# EAGLE schematic mainboard (EAGLE 9.1.3)

## Sheet 1 of 5: Avionics
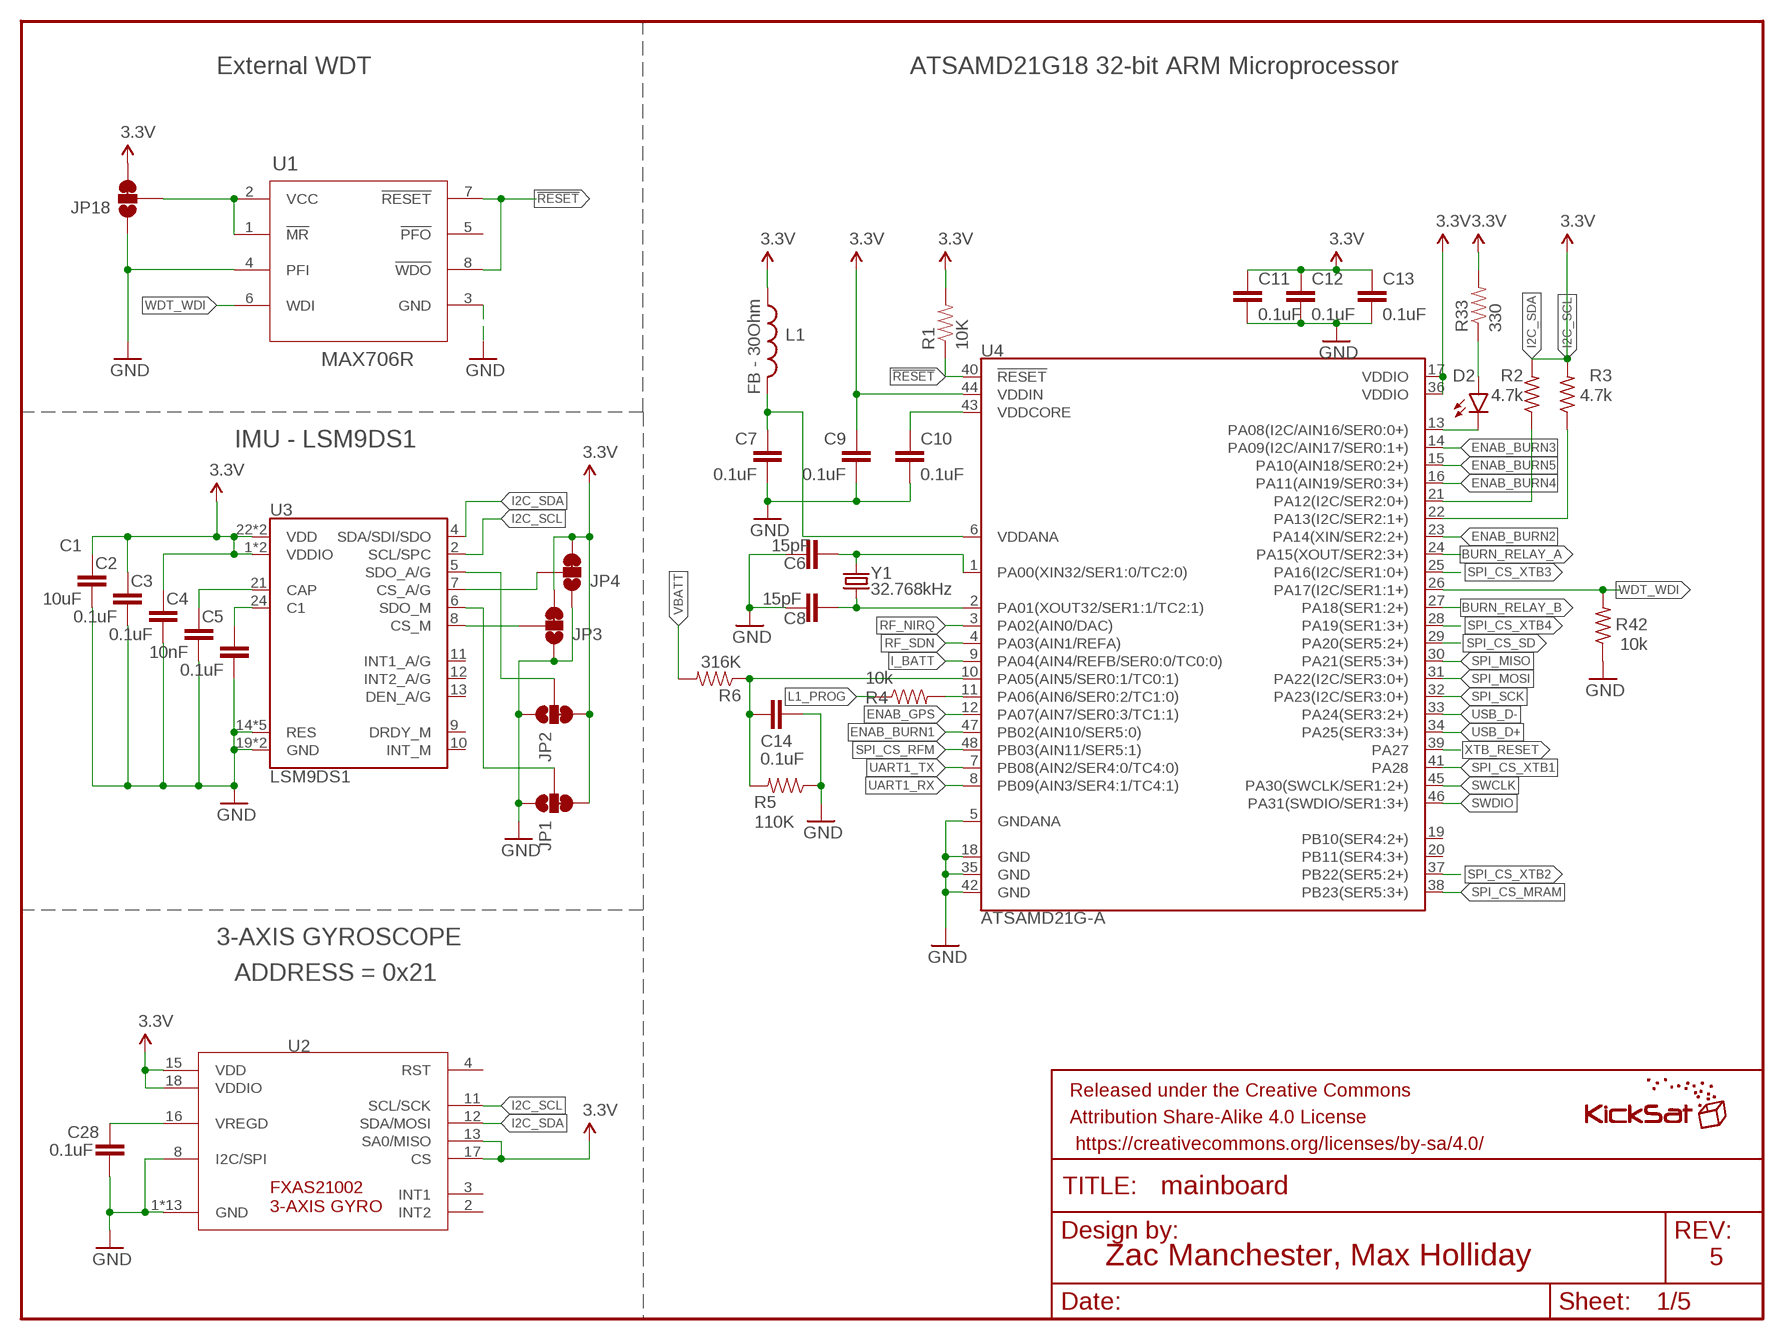
[diagram p0: schematic, sheet 1]

### Parts
C1  10uF  10UF-6.3V-20%(0603)  [0603-CAP]
C2  0.1uF  0.1UF-25V(+80/-20%)(0603)  [0603-CAP]
C3  0.1uF  0.1UF-25V(+80/-20%)(0603)  [0603-CAP]
C4  10nF  10NF/10000PF-50V-10%(0603)  [0603-CAP]
C5  0.1uF  0.1UF-25V(+80/-20%)(0603)  [0603-CAP]
C6  15pF  15PF-50V-5%(0603)  [0603-CAP@1]
C7  0.1uF  0.1UF-25V(+80/-20%)(0603)  [0603-CAP]
C8  15pF  15PF-50V-5%(0603)  [0603-CAP@1]
C9  0.1uF  0.1UF-25V(+80/-20%)(0603)  [0603-CAP]
C10  0.1uF  0.1UF-25V(+80/-20%)(0603)  [0603-CAP]
C11  0.1uF  0.1UF-25V(+80/-20%)(0603)  [0603-CAP]
C12  0.1uF  0.1UF-25V(+80/-20%)(0603)  [0603-CAP]
C13  0.1uF  0.1UF-25V(+80/-20%)(0603)  [0603-CAP]
C14  0.1uF  0.1UF-25V(+80/-20%)(0603)  [0603-CAP]
C28  0.1uF  0.1UF-25V(+80/-20%)(0603)  [0603-CAP]
D2  GREEN  LED-GREEN0603  [LED-0603]
FRAME1  FRAME-LETTER  [CREATIVE_COMMONS]
JP1  JUMPER-PAD-3-2OF3_NC_BY_TRACE_SMALL  [PAD-JUMPER-3-2OF3_NC_BY_TRACE_YES_SILK_FULL_BOX]
JP2  JUMPER-PAD-3-2OF3_NC_BY_TRACE_SMALL  [PAD-JUMPER-3-2OF3_NC_BY_TRACE_YES_SILK_FULL_BOX]
JP3  JUMPER-PAD-3-2OF3_NC_BY_TRACE_SMALL  [PAD-JUMPER-3-2OF3_NC_BY_TRACE_YES_SILK_FULL_BOX]
JP4  JUMPER-PAD-3-2OF3_NC_BY_TRACE_SMALL  [PAD-JUMPER-3-2OF3_NC_BY_TRACE_YES_SILK_FULL_BOX]
JP18  JUMPER-PAD-3-2OF3_NC_BY_TRACE_SMALL  [PAD-JUMPER-3-2OF3_NC_BY_TRACE_YES_SILK_FULL_BOX]
L1  FB - 30Ohm  INDUCTOR0603  [0603]
L2  KICKSAT_LOGO  [KICKSAT_LOGO]
R1  10K  10KOHM-1/10W-1%(0603)0603  [0603-RES]
R2  4.7k  R-US_R0603  [R0603]
R3  4.7k  R-US_R0603  [R0603]
R4  10k  10KOHM-1/10W-1%(0603)0603  [0603-RES]
R5  110K  10KOHM-1/10W-1%(0603)0603  [0603-RES]
R6  316K  10KOHM-1/10W-1%(0603)0603  [0603-RES]
R33  330  330OHM1/10W1%(0603)  [0603-RES]
R42  10k  R-US_R0603  [R0603]
U1  MAX706R  MAX708RESA-T  [SO8]
U2  FXAS21002FXAS21002  [QFN50P456X400X100-24]
U3  LSM9DS1  [LGA24-8X4]
U4  ATSAMD21G-A  [TQFP-48]
Y1  32.768kHz  CRYSTAL3.2X1.5MM  [CRYSTAL-SMD-3.2X1.5MM]

### Nets
3.3V: C1.1 C2.1 C3.1 C9.1 C11.1 C12.1 C13.1 JP1.3 JP2.3 JP3.3 JP4.3 JP18.3 L1.1 R1.2 R2.2 R3.2 R33.2 U2.13(SA0/MISO) U2.15(VDD) U2.17(CS) U2.18(VDDIO) U3.1(VDDIO) U3.3(VDDIO) U3.22(VDD) U3.23(VDD) U4.17(VDDIO) U4.36(VDDIO) U4.44(VDDIN) ; also sheet 2,3,4
!RESET: R1.1 U1.7(!RESET) U1.8(!WDO) U4.40(!RESET!) ; also sheet 3
BURN_RELAY_A: U4.24(PA15(XOUT/SER2:3+)) ; also sheet 5
BURN_RELAY_B: U4.27(PA18(SER1:2+)) ; also sheet 5
ENAB_BURN1: U4.47(PB02(AIN10/SER5:0)) ; also sheet 5
ENAB_BURN2: U4.23(PA14(XIN/SER2:2+)) ; also sheet 5
ENAB_BURN3: U4.14(PA09(I2C/AIN17/SER0:1+)) ; also sheet 5
ENAB_BURN4: U4.16(PA11(AIN19/SER0:3+)) ; also sheet 5
ENAB_BURN5: U4.15(PA10(AIN18/SER0:2+)) ; also sheet 5
ENAB_GPS: U4.12(PA07(AIN7/SER0:3/TC1:1)) ; also sheet 2
GND: C1.2 C2.2 C3.2 C4.2 C5.2 C6.1 C7.2 C8.2 C9.2 C10.2 C11.2 C12.2 C13.2 C14.2 C28.1 JP1.1 JP2.1 JP3.1 JP4.1 JP18.1 R5.1 R42.1 U1.3(GND) U1.4(PFI) U2.1(GND) U2.5(GND) U2.6(GND) U2.7(GND) U2.8(I2C/SPI) U2.9(GND) U2.10(GND) U2.14(GND) U2.19(GND) U2.20(GND) U2.21(GND) U2.22(GND) U2.23(GND) U2.24(GND) U3.14(RES) U3.15(RES) U3.16(RES) U3.17(RES) U3.18(RES) U3.19(GND) U3.20(GND) U4.5(GNDANA) U4.18(GND) U4.35(GND) U4.42(GND) ; also sheet 2,3,4,5
I2C_SCL: R3.1 U2.11(SCL/SCK) U3.2(SCL/SPC) U4.22(PA13(I2C/SER2:1+))
I2C_SDA: R2.1 U2.12(SDA/MOSI) U3.4(SDA/SDI/SDO) U4.21(PA12(I2C/SER2:0+))
I2C_SDOA/G: JP2.2 U3.5(SDO_A/G)
I_BATT: U4.9(PA04(AIN4/REFB/SER0:0/TC0:0)) ; also sheet 2
L1_PROG: R4.1 ; also sheet 2
N$1: D2.A R33.1
N$2: C4.1 U3.21(CAP)
N$6: C5.1 U3.24(C1)
N$8: JP18.2 U1.1(!MR) U1.2(VCC)
N$13: C14.1 R5.2 R6.1 U4.10(PA05(AIN5/SER0:1/TC0:1))
N$18: C7.1 L1.2 U4.6(VDDANA)
N$21: JP1.2 U3.6(SDO_M)
N$22: C28.2 U2.16(VREGD)
N$23: JP3.2 U3.8(CS_M)
N$26: JP4.2 U3.7(CS_A/G)
N$28: C6.2 U4.1(PA00(XIN32/SER1:0/TC2:0)) Y1.P$2
N$29: C8.1 U4.2(PA01(XOUT32/SER1:1/TC2:1)) Y1.P$1
N$39: R4.2 U4.11(PA06(AIN6/SER0:2/TC1:0))
N$53: D2.C U4.13(PA08(I2C/AIN16/SER0:0+))
RF_NIRQ: U4.3(PA02(AIN0/DAC)) ; also sheet 4
RF_SDN: U4.4(PA03(AIN1/REFA)) ; also sheet 4
SPI_CS_MRAM: U4.38(PB23(SER5:3+)) ; also sheet 3
SPI_CS_RFM: U4.48(PB03(AIN11/SER5:1)) ; also sheet 4
SPI_CS_SD: U4.29(PA20(SER5:2+)) ; also sheet 3
SPI_CS_XTB1: U4.41(PA28) ; also sheet 4
SPI_CS_XTB2: U4.37(PB22(SER5:2+)) ; also sheet 4
SPI_CS_XTB3: U4.25(PA16(I2C/SER1:0+)) ; also sheet 4
SPI_CS_XTB4: U4.28(PA19(SER1:3+)) ; also sheet 4
SPI_MISO: U4.30(PA21(SER5:3+)) ; also sheet 3,4
SPI_MOSI: U4.31(PA22(I2C/SER3:0+)) ; also sheet 3,4
SPI_SCK: U4.32(PA23(I2C/SER3:0+)) ; also sheet 3,4
SWCLK: U4.45(PA30(SWCLK/SER1:2+)) ; also sheet 3
SWDIO: U4.46(PA31(SWDIO/SER1:3+)) ; also sheet 3
UART1_RX: U4.8(PB09(AIN3/SER4:1/TC4:1)) ; also sheet 4
UART1_TX: U4.7(PB08(AIN2/SER4:0/TC4:0)) ; also sheet 4
USB_D+: U4.34(PA25(SER3:3+)) ; also sheet 3
USB_D-: U4.33(PA24(SER3:2+)) ; also sheet 3
VBATT: R6.2 ; also sheet 2,3,5
VDDCORE3: C10.1 U4.43(VDDCORE)
WDT_WDI: R42.2 U1.6(WDI) U4.26(PA17(I2C/SER1:1+))
XTB_RESET: U4.39(PA27) ; also sheet 4
Unconnected: U1.5(!PFO) U2.2(INT2) U2.3(INT1) U2.4(RST) U3.9(DRDY_M) U3.10(INT_M) U3.11(INT1_A/G) U3.12(INT2_A/G) U3.13(DEN_A/G) U4.19(PB10(SER4:2+)) U4.20(PB11(SER4:3+))

### Notes on the sheet
- ATSAMD21G18 32-bit ARM Microprocessor
- External WDT
- Decide on HOLD and !WP
- IMU - LSM9DS1
- 3-AXIS GYROSCOPE
- To Do:
  Characterize power consumption
  Validate SPI pinout of SAMD21
- ADDRESS = 0x21
- Zac Manchester, Max Holliday | 5

## Sheet 2 of 5: Power
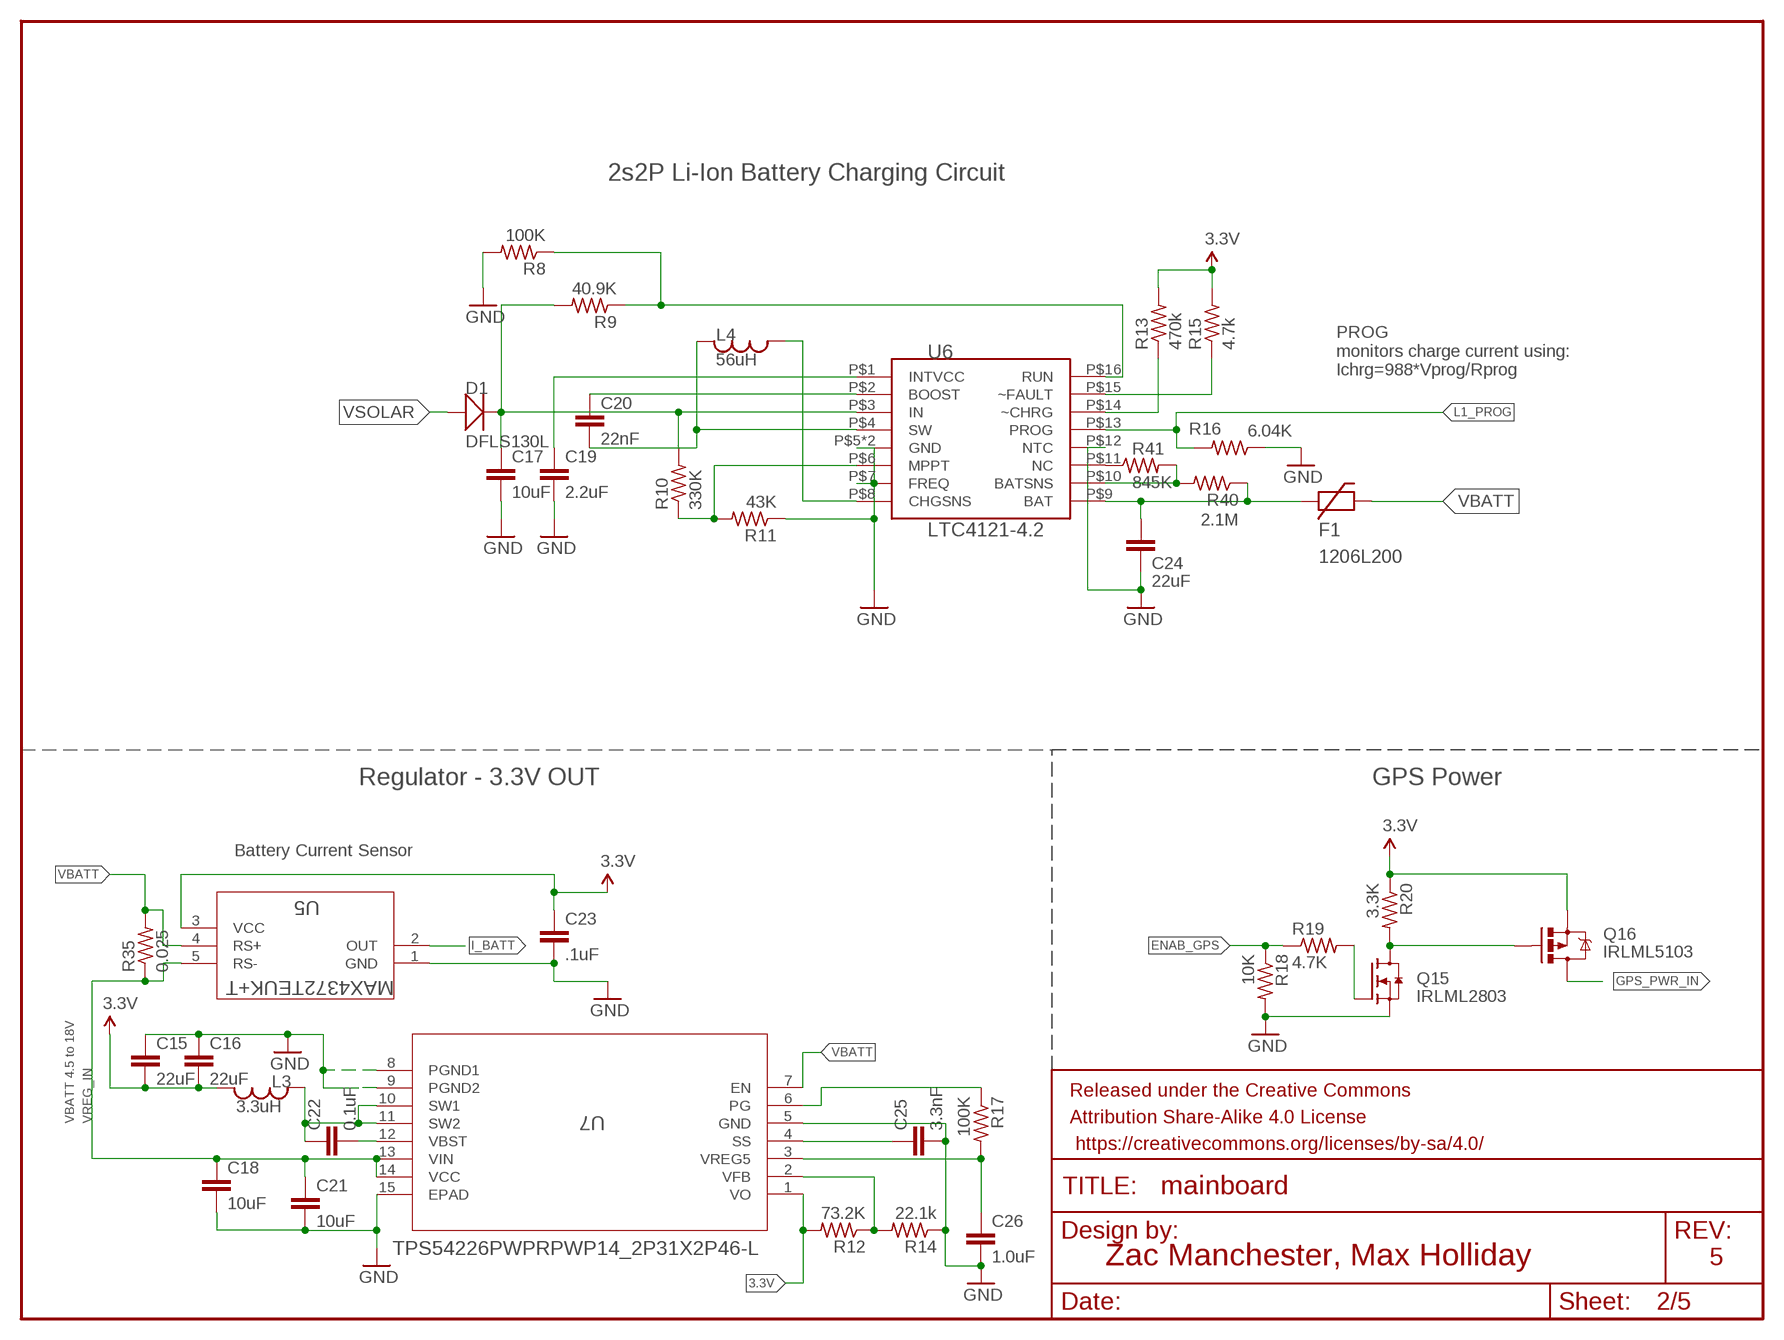
[diagram p1: schematic, sheet 2]

### Parts
C15  22uF  22UF-0805-6.3V-20%  [0805]
C16  22uF  22UF-0805-6.3V-20%  [0805]
C17  10uF  10UF-0603-6.3V-20%  [0603]
C18  10uF  10UF-0603-6.3V-20%  [0603]
C19  2.2uF  2.2UF-0603-10V-20%  [0603]
C20  22nF  2.2NF/2200PF-0603-50V-10%  [0603]
C21  10uF  10UF-0603-6.3V-20%  [0603]
C22  0.1uF  1.0UF-0603-16V-10%  [0603]
C23  .1uF  CAP0603-CAP  [0603-CAP@1]
C24  22uF  0.1UF-0603-25V-5%  [0603]
C25  3.3nF  3.3NF-0603-100V-10%  [0603]
C26  1.0uF  1.0UF-0603-16V-10%  [0603]
D1  DFLS130L  [PWRDI-123]
F1  1206L200  PTCFUSE1206  [1206]
FRAME2  FRAME-LETTER  [CREATIVE_COMMONS]
L3  3.3uH  IND1812  [1812]
L4  56uH  IND1812  [1812]
Q15  IRLML2803  IRLML2803TRPBF  [SOT-23]
Q16  IRLML5103  MOSFET-PCHANNEL  [SOT23-3]
R8  100K  R-US_R0603  [R0603]
R9  40.9K  R-US_R0603  [R0603]
R10  330K  R-US_R0603  [R0603]
R11  43K  R-US_R0603  [R0603]
R12  73.2K  R-US_R0603  [R0603]
R13  470k  R-US_R0603  [R0603]
R14  22.1k  R-US_R0603  [R0603]
R15  4.7k  R-US_R0603  [R0603]
R16  6.04K  R-US_R0603  [R0603]
R17  100K  R-US_R0603  [R0603]
R18  10K  R-US_R0603  [R0603]
R19  4.7K  R-US_R0603  [R0603]
R20  3.3K  R-US_R0603  [R0603]
R35  0.025  R-US_R2512  [R2512]
R40  2.1M  R-US_R0603  [R0603]
R41  845K  R-US_R0603  [R0603]
U5  MAX4372TEUK+T  [21-0057F]
U6  LTC4121-4.2  [QFN-16-PAD]
U7  TPS54226PWPRPWP14_2P31X2P46-L  [PWP14_2P31X2P46-L]

### Nets
3.3V: C15.2 C16.2 C23.1 L3.P$1 Q16.2(S) R12.2 R13.2 R15.2 R20.1 U5.3(VCC) U7.1(VO) ; also sheet 1,3,4
ENAB_GPS: R18.1 R19.1 ; also sheet 1
GND: C15.1 C16.1 C17.2 C18.2 C19.2 C21.2 C23.2 C24.2 C25.2 C26.2 Q15.2(S) R8.2 R11.1 R14.1 R16.1 R18.2 U5.1(GND) U6.P$5(GND) U6.P$7(FREQ) U6.P$12(NTC) U6.P$17(GND) U7.5(GND) U7.8(PGND1) U7.9(PGND2) U7.15(EPAD) ; also sheet 1,3,4,5
GPS_PWR_IN: Q16.3(D) ; also sheet 4
I_BATT: U5.2(OUT) ; also sheet 1
L1_CHG: R8.1 R9.1 U6.P$16(RUN)
L1_FAULTN: R15.1 U6.P$15(~FAULT)
L1_PROG: R16.2 U6.P$13(PROG) ; also sheet 1
LION1: C24.1 F1.1 R40.1 U6.P$9(BAT)
N$3: C22.1 L3.P$2 U7.10(SW1) U7.11(SW2)
N$10: Q15.1(G) R19.2
N$12: Q15.3(D) Q16.1(G) R20.2
N$14: C22.2 U7.12(VBST)
N$31: R40.2 R41.2 U6.P$10(BATSNS)
N$32: C20.2 L4.P$1 U6.P$4(SW)
N$33: C20.1 U6.P$2(BOOST)
N$34: C19.1 U6.P$1(INTVCC)
N$35: R10.1 R11.2 U6.P$6(MPPT)
N$36: L4.P$2 U6.P$8(CHGSNS)
N$37: R13.1 U6.P$14(~CHRG)
N$46: C26.1 R17.2 U7.3(VREG5)
N$51: C25.1 U7.4(SS)
N$52: R12.1 R14.2 U7.2(VFB)
N$54: R41.1 U6.P$11(NC)
PGOOD: R17.1 U7.6(PG)
VBATT: F1.2 R35.2 U5.4(RS+) U7.7(EN) ; also sheet 1,3,5
VREG_IN: C18.1 C21.1 R35.1 U5.5(RS-) U7.13(VIN) U7.14(VCC)
VSOLAR: D1.A ; also sheet 5
VSOLAR_IN: C17.1 D1.C R9.2 R10.2 U6.P$3(IN)

### Notes on the sheet
- 2s2P Li-Ion Battery Charging Circuit
- PROG
  monitors charge current using:
  Ichrg=988*Vprog/Rprog
- Regulator - 3.3V OUT | GPS Power
- Battery Current Sensor
- VBATT 4.5 to 18V
- Zac Manchester, Max Holliday | 5

## Sheet 3 of 5: Connectors
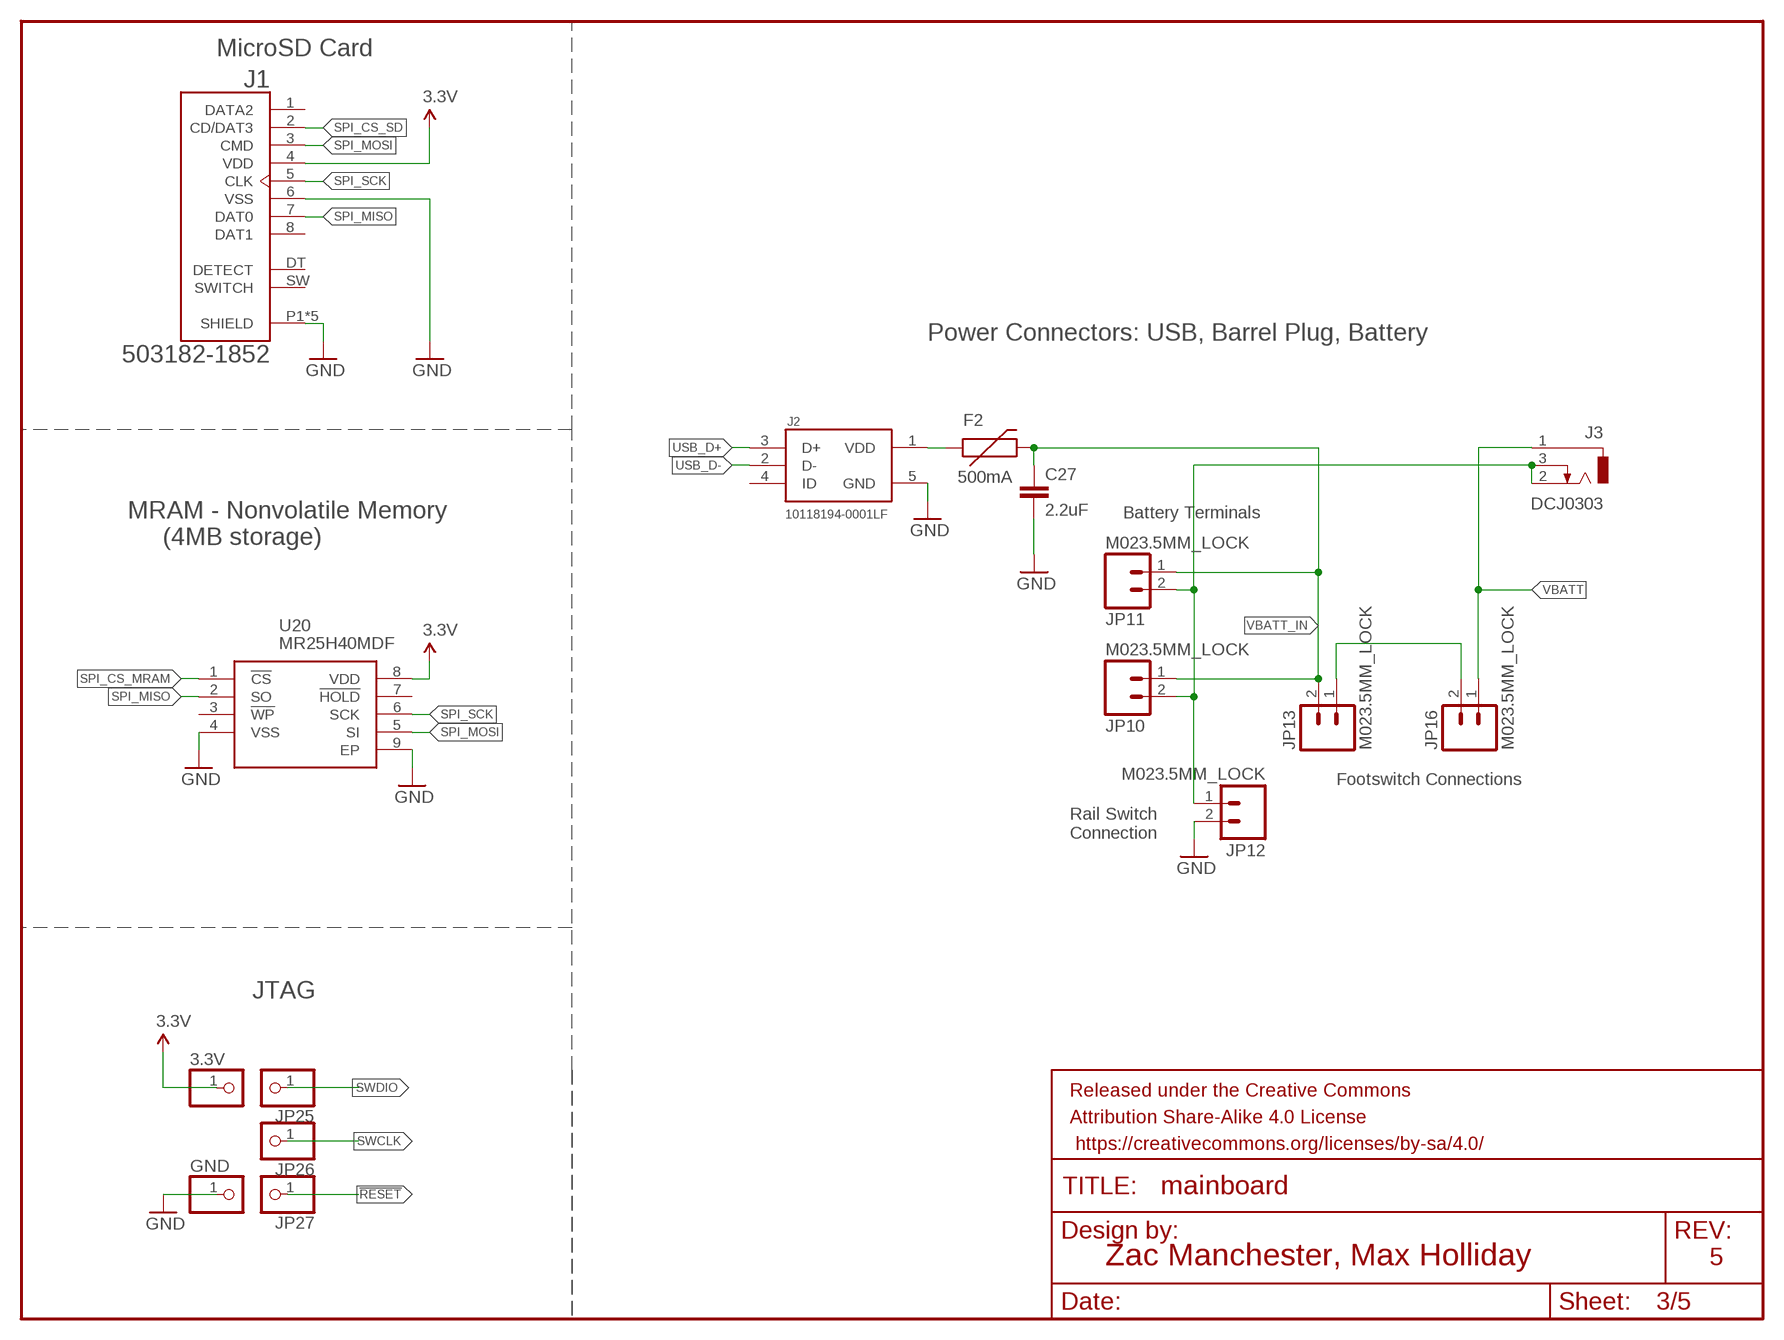
[diagram p2: schematic, sheet 3]

### Parts
3.3V  PINHD-1X1  [1X01]
C27  2.2uF  2.2UF-0603-10V-20%  [0603]
F2  500mA  PTCSMD  [PTC-1206]
FRAME3  FRAME-LETTER  [CREATIVE_COMMONS]
GND  PINHD-1X1  [1X01]
J1  503182-1852  [MOLEX_503182-1852]
J2  10118194-0001LF  [FRAMATOME_10118194-0001LF]
J3  DCJ0303  [DCJ0303]
JP10  M023.5MM_LOCK  [SCREWTERMINAL-3.5MM-2_LOCK]
JP11  M023.5MM_LOCK  [SCREWTERMINAL-3.5MM-2_LOCK]
JP12  M023.5MM_LOCK  [SCREWTERMINAL-3.5MM-2_LOCK]
JP13  M023.5MM_LOCK  [SCREWTERMINAL-3.5MM-2_LOCK]
JP16  M023.5MM_LOCK  [SCREWTERMINAL-3.5MM-2_LOCK]
JP25  PINHD-1X1  [1X01]
JP26  PINHD-1X1  [1X01]
JP27  PINHD-1X1  [1X01]
U20  MR25H40MDF  [SON127P600X500X90-9N]

### Nets
3.3V: 3.3V.1 J1.4(VDD) U20.8(VDD) ; also sheet 1,2,4
!RESET: JP27.1 ; also sheet 1
GND: C27.2 GND.1 J1.6(VSS) J1.P1(SHIELD) J1.P2(SHIELD) J1.P3(SHIELD) J1.P4(SHIELD) J1.P5(SHIELD) J2.5(GND) JP12.2 U20.4(VSS) U20.9(EP) ; also sheet 1,2,4,5
N$4: JP13.1 JP16.2
N$20: F2.1 J2.1(VDD)
N$43: J3.2 J3.3 JP10.2 JP11.2 JP12.1
SPI_CS_MRAM: U20.1(!CS) ; also sheet 1
SPI_CS_SD: J1.2(CD/DAT3) ; also sheet 1
SPI_MISO: J1.7(DAT0) U20.2(SO) ; also sheet 1,4
SPI_MOSI: J1.3(CMD) U20.5(SI) ; also sheet 1,4
SPI_SCK: J1.5(CLK) U20.6(SCK) ; also sheet 1,4
SWCLK: JP26.1 ; also sheet 1
SWDIO: JP25.1 ; also sheet 1
USB_D+: J2.3(D+) ; also sheet 1
USB_D-: J2.2(D-) ; also sheet 1
VBATT: J3.1 JP16.1 ; also sheet 1,2,5
VBATT_IN: C27.1 F2.2 JP10.1 JP11.1 JP13.2
Unconnected: J1.1(DATA2) J1.8(DAT1) J1.DT(DETECT) J1.SW(SWITCH) J2.4(ID) U20.3(!WP) U20.7(!HOLD)

### Notes on the sheet
- MicroSD Card
- Power Connectors: USB, Barrel Plug, Battery
- MRAM - Nonvolatile Memory
       (4MB storage)
- Battery Terminals
- Footswitch Connections
- Rail Switch
  Connection
- JTAG
- Zac Manchester, Max Holliday | 5

## Sheet 4 of 5: RF and GPS
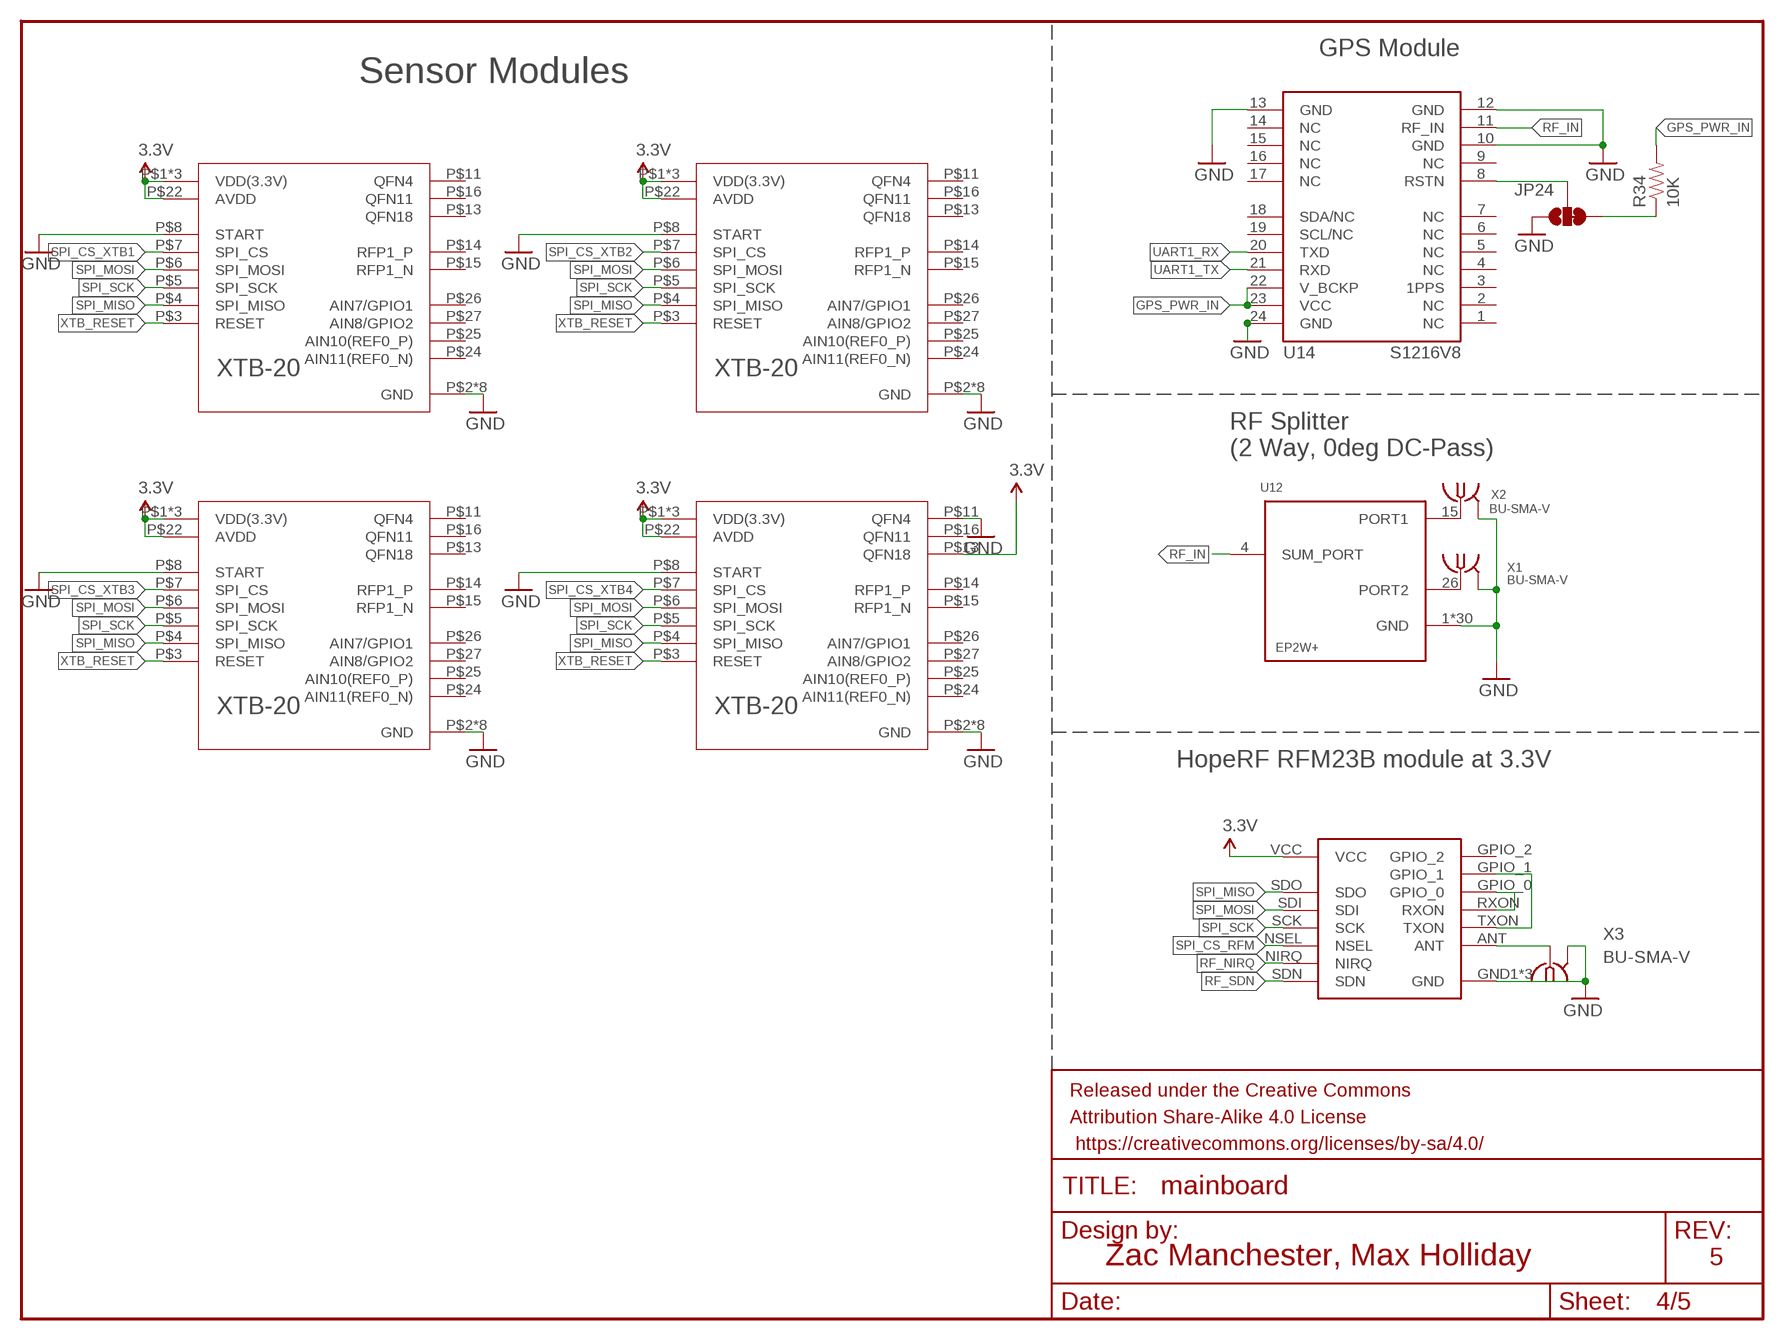
[diagram p3: schematic, sheet 4]

### Parts
FRAME4  FRAME-LETTER  [CREATIVE_COMMONS]
JP24  JUMPER-PAD-3-2OF3_NC_BY_TRACE_SMALL  [PAD-JUMPER-3-2OF3_NC_BY_TRACE_YES_SILK_FULL_BOX]
R34  10K  10KOHM-1/10W-1%(0603)0603  [0603-RES]
U12  EP2W+  [QFN32-5X5MM]
U13  RFM23BP  [RFM23BP]
U14  S1216V8  [S1216_24PIN_PACKAGE]
U15  XTB_2018_07_15  [XTB28_MEZ]
U16  XTB_2018_07_15  [XTB28_MEZ]
U17  XTB_2018_07_15  [XTB28_MEZ]
U18  XTB_2018_07_15  [XTB28_MEZ]
X1  BU-SMA-V  [BU-SMA-V]
X2  BU-SMA-V  [BU-SMA-V]
X3  BU-SMA-V  [BU-SMA-V]

### Nets
3.3V: U13.VCC U15.P$1(VDD(3.3V)) U15.P$20(VDD(3.3V)) U15.P$22(AVDD) U15.P$28(VDD(3.3V)) U16.P$1(VDD(3.3V)) U16.P$20(VDD(3.3V)) U16.P$22(AVDD) U16.P$28(VDD(3.3V)) U17.P$1(VDD(3.3V)) U17.P$20(VDD(3.3V)) U17.P$22(AVDD) U17.P$28(VDD(3.3V)) U18.P$1(VDD(3.3V)) U18.P$13(QFN18) U18.P$20(VDD(3.3V)) U18.P$22(AVDD) U18.P$28(VDD(3.3V)) ; also sheet 1,2,3
GND: JP24.1 U12.1(GND) U12.2(GND) U12.3(GND) U12.5(GND) U12.6(GND) U12.7(GND) U12.8(GND) U12.9(GND) U12.10(GND) U12.11(GND) U12.12(GND) U12.13(GND) U12.14(GND) U12.16(GND) U12.17(GND) U12.18(GND) U12.19(GND) U12.20(GND) U12.21(GND) U12.22(GND) U12.23(GND) U12.24(GND) U12.25(GND) U12.27(GND) U12.28(GND) U12.29(GND) U12.30(GND) U12.31(GND) U12.32(GND) U12.EP(GND) U13.GND1(GND) U13.GND2(GND) U13.GND3(GND) U14.10(GND) U14.12(GND) U14.13(GND) U14.24(GND) U15.P$2(GND) U15.P$8(START) U15.P$9(GND) U15.P$10(GND) U15.P$12(GND) U15.P$17(GND) U15.P$19(GND) U15.P$21(GND) U15.P$23(GND) U16.P$2(GND) U16.P$8(START) U16.P$9(GND) U16.P$10(GND) U16.P$12(GND) U16.P$17(GND) U16.P$19(GND) U16.P$21(GND) U16.P$23(GND) U17.P$2(GND) U17.P$8(START) U17.P$9(GND) U17.P$10(GND) U17.P$12(GND) U17.P$17(GND) U17.P$19(GND) U17.P$21(GND) U17.P$23(GND) U18.P$2(GND) U18.P$8(START) U18.P$9(GND) U18.P$10(GND) U18.P$11(QFN4) U18.P$12(GND) U18.P$17(GND) U18.P$19(GND) U18.P$21(GND) U18.P$23(GND) X1.2 X1.3 X1.4 X1.5 X2.2 X2.3 X2.4 X2.5 X3.2 X3.3 X3.4 X3.5 ; also sheet 1,2,3,5
GPS_PWR_IN: R34.2 U14.22(V_BCKP) U14.23(VCC) ; also sheet 2
N$9: JP24.2 U14.8(RSTN)
N$16: U12.15(PORT1) X2.1
N$17: U12.26(PORT2) X1.1
N$19: U13.ANT X3.1
N$24: JP24.3 R34.1
N$49: U13.GPIO_0 U13.RXON
N$55: U13.GPIO_1 U13.TXON
RF_IN: U12.4(SUM_PORT) U14.11(RF_IN)
RF_NIRQ: U13.NIRQ ; also sheet 1
RF_SDN: U13.SDN ; also sheet 1
SPI_CS_RFM: U13.NSEL ; also sheet 1
SPI_CS_XTB1: U15.P$7(SPI_CS) ; also sheet 1
SPI_CS_XTB2: U16.P$7(SPI_CS) ; also sheet 1
SPI_CS_XTB3: U17.P$7(SPI_CS) ; also sheet 1
SPI_CS_XTB4: U18.P$7(SPI_CS) ; also sheet 1
SPI_MISO: U13.SDO U15.P$4(SPI_MISO) U16.P$4(SPI_MISO) U17.P$4(SPI_MISO) U18.P$4(SPI_MISO) ; also sheet 1,3
SPI_MOSI: U13.SDI U15.P$6(SPI_MOSI) U16.P$6(SPI_MOSI) U17.P$6(SPI_MOSI) U18.P$6(SPI_MOSI) ; also sheet 1,3
SPI_SCK: U13.SCK U15.P$5(SPI_SCK) U16.P$5(SPI_SCK) U17.P$5(SPI_SCK) U18.P$5(SPI_SCK) ; also sheet 1,3
UART1_RX: U14.20(TXD) ; also sheet 1
UART1_TX: U14.21(RXD) ; also sheet 1
XTB_RESET: U15.P$3(RESET) U16.P$3(RESET) U17.P$3(RESET) U18.P$3(RESET) ; also sheet 1
Unconnected: U13.GPIO_2 U14.1(NC) U14.2(NC) U14.3(1PPS) U14.4(NC) U14.5(NC) U14.6(NC) U14.7(NC) U14.9(NC) U14.14(NC) U14.15(NC) U14.16(NC) U14.17(NC) U14.18(SDA/NC) U14.19(SCL/NC) U15.P$11(QFN4) U15.P$13(QFN18) U15.P$14(RFP1_P) U15.P$15(RFP1_N) U15.P$16(QFN11) U15.P$24(AIN11(REF0_N)) U15.P$25(AIN10(REF0_P)) U15.P$26(AIN7/GPIO1) U15.P$27(AIN8/GPIO2) U16.P$11(QFN4) U16.P$13(QFN18) U16.P$14(RFP1_P) U16.P$15(RFP1_N) U16.P$16(QFN11) U16.P$24(AIN11(REF0_N)) U16.P$25(AIN10(REF0_P)) U16.P$26(AIN7/GPIO1) U16.P$27(AIN8/GPIO2) U17.P$11(QFN4) U17.P$13(QFN18) U17.P$14(RFP1_P) U17.P$15(RFP1_N) U17.P$16(QFN11) U17.P$24(AIN11(REF0_N)) U17.P$25(AIN10(REF0_P)) U17.P$26(AIN7/GPIO1) U17.P$27(AIN8/GPIO2) U18.P$14(RFP1_P) U18.P$15(RFP1_N) U18.P$16(QFN11) U18.P$24(AIN11(REF0_N)) U18.P$25(AIN10(REF0_P)) U18.P$26(AIN7/GPIO1) U18.P$27(AIN8/GPIO2)

### Notes on the sheet
- GPS Module
- Sensor Modules
- RF Splitter 
  (2 Way, 0deg DC-Pass)
- HopeRF RFM23B module at 3.3V
- Modifications are currently needed
  to the module for radiation tolerance
- Zac Manchester, Max Holliday | 5

## Sheet 5 of 5: Burn Wires
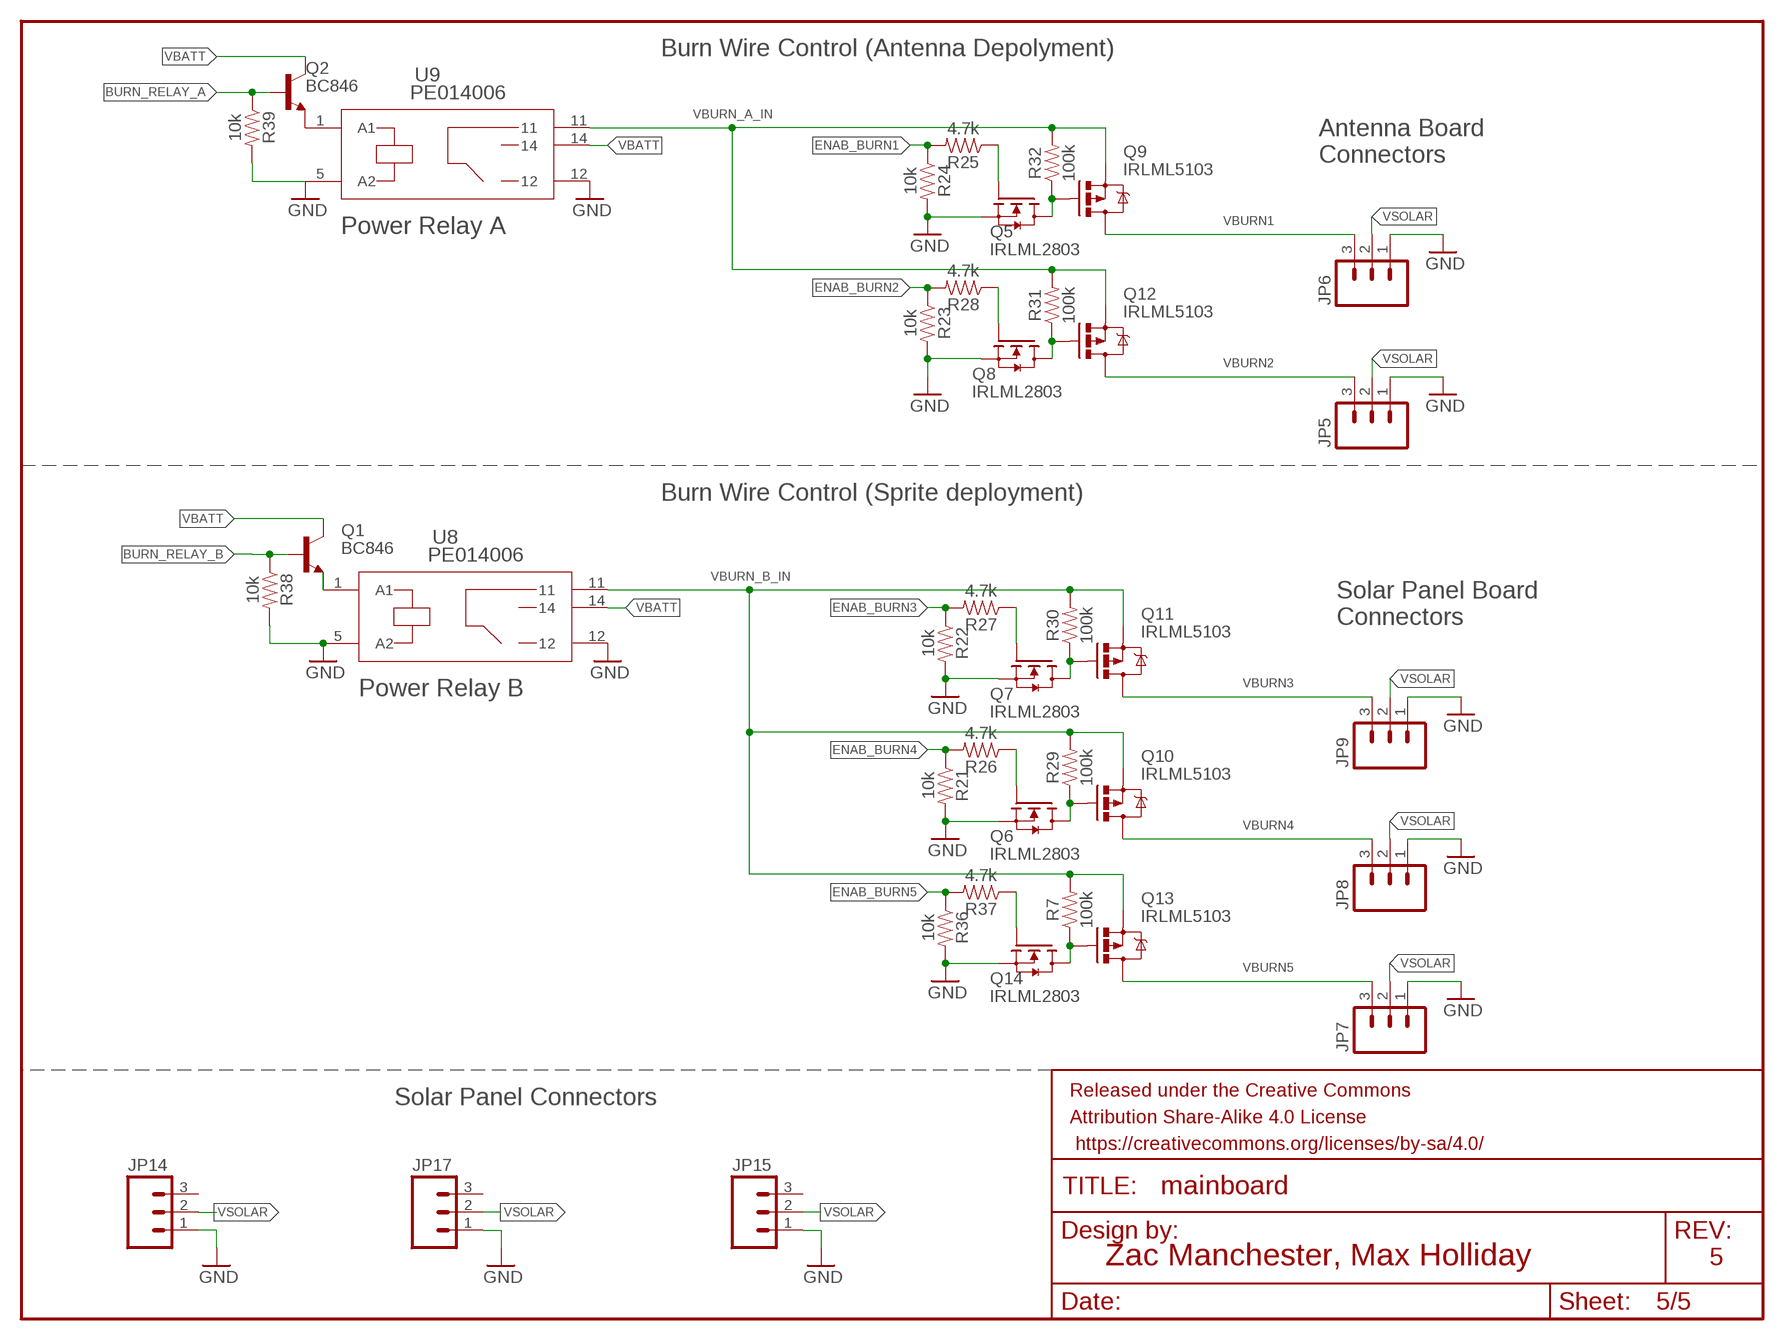
[diagram p4: schematic, sheet 5]

### Parts
FRAME5  FRAME-LETTER  [CREATIVE_COMMONS]
JP5  M03POLAR_LOCK  [MOLEX-1X3_LOCK]
JP6  M03POLAR_LOCK  [MOLEX-1X3_LOCK]
JP7  M03POLAR_LOCK  [MOLEX-1X3_LOCK]
JP8  M03POLAR_LOCK  [MOLEX-1X3_LOCK]
JP9  M03POLAR_LOCK  [MOLEX-1X3_LOCK]
JP14  M03POLAR_LOCK  [MOLEX-1X3_LOCK]
JP15  M03POLAR_LOCK  [MOLEX-1X3_LOCK]
JP17  M03POLAR_LOCK  [MOLEX-1X3_LOCK]
Q1  BC846  [SOT23]
Q2  BC846  [SOT23]
Q5  IRLML2803  IRLML2803TRPBF  [SOT-23]
Q6  IRLML2803  IRLML2803TRPBF  [SOT-23]
Q7  IRLML2803  IRLML2803TRPBF  [SOT-23]
Q8  IRLML2803  IRLML2803TRPBF  [SOT-23]
Q9  IRLML5103  MOSFET-PCHANNEL  [SOT23-3]
Q10  IRLML5103  MOSFET-PCHANNEL  [SOT23-3]
Q11  IRLML5103  MOSFET-PCHANNEL  [SOT23-3]
Q12  IRLML5103  MOSFET-PCHANNEL  [SOT23-3]
Q13  IRLML5103  MOSFET-PCHANNEL  [SOT23-3]
Q14  IRLML2803  IRLML2803TRPBF  [SOT-23]
R7  100k  RESISTOR0603  [0603]
R21  10k  RESISTOR0603  [0603]
R22  10k  RESISTOR0603  [0603]
R23  10k  RESISTOR0603  [0603]
R24  10k  RESISTOR0603  [0603]
R25  4.7k  RESISTOR0603  [0603]
R26  4.7k  RESISTOR0603  [0603]
R27  4.7k  RESISTOR0603  [0603]
R28  4.7k  RESISTOR0603  [0603]
R29  100k  RESISTOR0603  [0603]
R30  100k  RESISTOR0603  [0603]
R31  100k  RESISTOR0603  [0603]
R32  100k  RESISTOR0603  [0603]
R36  10k  RESISTOR0603  [0603]
R37  4.7k  RESISTOR0603  [0603]
R38  10k  RESISTOR0603  [0603]
R39  10k  RESISTOR0603  [0603]
U8  PE014006  PE014005  [RELAY5-PE_CO]
U9  PE014006  PE014005  [RELAY5-PE_CO]

### Nets
BURN_RELAY_A: Q2.1(B) R39.1 ; also sheet 1
BURN_RELAY_B: Q1.1(B) R38.1 ; also sheet 1
ENAB_BURN1: R24.1 R25.2 ; also sheet 1
ENAB_BURN2: R23.1 R28.2 ; also sheet 1
ENAB_BURN3: R22.1 R27.2 ; also sheet 1
ENAB_BURN4: R21.1 R26.2 ; also sheet 1
ENAB_BURN5: R36.1 R37.2 ; also sheet 1
GND: JP5.1 JP6.1 JP7.1 JP8.1 JP9.1 JP14.1 JP15.1 JP17.1 Q5.2(S) Q6.2(S) Q7.2(S) Q8.2(S) Q14.2(S) R21.2 R22.2 R23.2 R24.2 R36.2 R38.2 U8.5(A2) U8.12 U9.5(A2) U9.12 ; also sheet 1,2,3,4
GND4: R39.2
N$5: Q6.1(G) R26.1
N$7: Q5.3(D) Q9.1(G) R32.1
N$11: Q5.1(G) R25.1
N$15: Q8.3(D) Q12.1(G) R31.1
N$25: Q8.1(G) R28.1
N$30: Q7.1(G) R27.1
N$38: Q2.2(E) U9.1(A1)
N$40: Q1.2(E) U8.1(A1)
N$44: Q7.3(D) Q11.1(G) R30.1
N$47: Q6.3(D) Q10.1(G) R29.1
N$56: Q13.1(G) Q14.3(D) R7.1
N$57: Q14.1(G) R37.1
VBATT: Q1.3(C) Q2.3(C) U8.14 U9.14 ; also sheet 1,2,3
VBURN1: JP6.3 Q9.3(D)
VBURN2: JP5.3 Q12.3(D)
VBURN3: JP9.3 Q11.3(D)
VBURN4: JP8.3 Q10.3(D)
VBURN5: JP7.3 Q13.3(D)
VBURN_A_IN: Q9.2(S) Q12.2(S) R31.2 R32.2 U9.11
VBURN_B_IN: Q10.2(S) Q11.2(S) Q13.2(S) R7.2 R29.2 R30.2 U8.11
VSOLAR: JP5.2 JP6.2 JP7.2 JP8.2 JP9.2 JP14.2 JP15.2 JP17.2 ; also sheet 2
Unconnected: JP14.3 JP15.3 JP17.3

### Notes on the sheet
- Burn Wire Control (Antenna Depolyment)
- Antenna Board
  Connectors
- Power Relay A
- Burn Wire Control (Sprite deployment)
- Solar Panel Board
  Connectors
- Power Relay B
- Solar Panel Connectors
- Zac Manchester, Max Holliday | 5

## Library data of the parts
3.3V GND JP25-JP27 = pinhead:PINHD-1X1: PIN HEADER
C1 = SparkFun-Capacitors:10UF-6.3V-20%(0603): CAP-11015; PROD_ID: CAP-11015
C2 C3 C5 C7 C9-C14 C28 = SparkFun-Capacitors:0.1UF-25V(+80/-20%)(0603): CAP-00810 Ceramic Standard decoupling cap; PROD_ID: CAP-00810
C4 = SparkFun-Capacitors:10NF/10000PF-50V-10%(0603): CAP-00867; PROD_ID: CAP-00867
C6 C8 = SparkFun-Capacitors:15PF-50V-5%(0603): CAP-07881; PROD_ID: CAP-07881
C15 C16 = SparkFun-Capacitors:22UF: 22µF ceramic capacitors A capacitor is a passive two-terminal electrical component used to store electrical energy temporarily in an electric field.; PROD_ID: CAP-08402
C17 C18 C21 = SparkFun-Capacitors:10UF: 10.0µF ceramic capacitors A capacitor is a passive two-terminal electrical component used to store electrical energy temporarily in an electric field.; PROD_ID: CAP-11015
C19 C27 = SparkFun-Capacitors:2.2UF: 2.2µF ceramic capacitors A capacitor is a passive two-terminal electrical component used to store electrical energy temporarily in an electric field.; PROD_ID: CAP-07888
C20 = SparkFun-Capacitors:2.2NF/2200PF: 2.2nF/2,200pF ceramic capacitors A capacitor is a passive two-terminal electrical component used to store electrical energy temporarily in an electric field.; PROD_ID: CAP-07877; VALUE: 2.2nF
C22 = SparkFun-Capacitors:1.0UF: 1µF ceramic capacitors A capacitor is a passive two-terminal electrical component used to store electrical energy temporarily in an electric field.; PROD_ID: CAP-00868; VALUE: 1.0uF
C23 = SparkFun-Capacitors:CAP: Capacitor Standard 0603 ceramic capacitor, and 0.1" leaded capacitor.
C24 = SparkFun-Capacitors:0.1UF: 0.1µF ceramic capacitors A capacitor is a passive two-terminal electrical component used to store electrical energy temporarily in an electric field.; PROD_ID: CAP-08604; VALUE: 0.1uF
C25 = SparkFun-Capacitors:3.3NF: 3.3nF ceramic capacitors A capacitor is a passive two-terminal electrical component used to store electrical energy temporarily in an electric field.; PROD_ID: CAP-09633
C26 = SparkFun-Capacitors:1.0UF: 1µF ceramic capacitors A capacitor is a passive two-terminal electrical component used to store electrical energy temporarily in an electric field.; PROD_ID: CAP-00868
D1 = BrownSpaceEngineering:DFLS130L
D2 = SparkFun-LED:LED-GREEN: Various green LEDs Green LEDs used in SFE Production 0603- DIO-00821 LARGE- DIO-00862 LILYPAD- DIO-09910; PROD_ID: DIO-00821
F1 = BrownSpaceEngineering:PTCFUSE: PTC Fuse
F2 = SparkFun-PowerIC:PTC: Resettable Fuse PTC Resettable Fuse. Spark Fun Electronics SKU : COM-08357; PROD_ID: RES-11150
FRAME1 FRAME2 FRAME4 = SparkFun-Aesthetics:FRAME-LETTER: Schematic Frame - Letter Standard 8.5x11 US Letter frame
FRAME3 FRAME5 = SparkFun-Aesthetics:FRAME-LETTER: Schematic Frame Standard 8.5x11 US Letter frame
J1 = maholli:503182-1852: Conn Micro SD Card M 8 POS 1.09mm Solder RA SMD Embossed T/R 0.5A/Contact; DESCRIPTION: 1.10mm Pitch microSD Memory Card Connector, Normal Mount Surface Mount, Push-Push Type, 1.45mm Height, Anti-card fly-out; DIGI-KEY_PART_NUMBER: WM12834CT-ND; DIGI-KEY_PURCHASE_URL: https://www.digikey.com/product-detail/en/molex-llc/5031821852/WM12834CT-ND/5823232?WT.z_cid=ref_snapeda&utm_source=snapeda&utm_medium=aggregator&utm_campaign=buynow; MF: Molex; MP: 5031821852; PACKAGE: None
J2 = 10118194-0001LF:10118194-0001LF: Conn Micro USB Type B RCP 5 POS 0.65mm Solder RA SMD 5 Terminal 1 Port T/R; AVAILABILITY: Warning; DESCRIPTION: Micro Usb, 2.0 Type b, Rcpt, Smt; MF: Amphenol; MP: 10118194-0001LF; PACKAGE: None; PRICE: 0.26 USD
J3 = maholli:DCJ0303: DC POWER JACK Source: DCJ0303.pdf; OC_FARNELL: unknown; OC_NEWARK: unknown
JP1-JP4 JP18 JP24 = SparkFun-Passives:JUMPER-PAD-3-2OF3_NC_BY_TRACE
JP5-JP9 JP14 JP15 JP17 = SparkFun-Connectors:M03: Header 3 Standard 3-pin 0.1" header. Use with straight break away headers (SKU : PRT-00116), right angle break away headers (PRT-00553), swiss pins (PRT-00743), machine pins (PRT-00117), and female headers (PRT-00115). Molex polarized connector foot print use with SKU : PRT-08232 with associated crimp pins and housings.
JP10-JP13 JP16 = SparkFun-Connectors:M02: Standard 2-pin 0.1" header. Use with - straight break away headers ( PRT-00116) - right angle break away headers (PRT-00553) - swiss pins (PRT-00743) - machine pins (PRT-00117) - female headers (PRT-00115) Molex polarized connector foot print use with: PRT-08233 with associated crimp pins and housings. 2.54_SCREWTERM for use with PRT-10571. 3.5mm Screw Terminal footprints for PRT-08084 5mm Screw Terminal footprints for use with PRT-08432; PROD_ID: CONN-08399
L1 = SparkFun-Passives:INDUCTOR: Inductors Basic Inductor/Choke - 0603 and 1206. Footprints are not proven and vary greatly between part numbers. INDUCTOR POWER 3.3UH 4.0A SMD 0.197" L x 0.197" W x 0.177" H (5.00mm x 5.00mm x 4.50mm); PROD_ID: RES-07859
L2 = KickSat-Logo:KICKSAT_LOGO
L3 L4 = BrownSpaceEngineering:IND
Q1 Q2 = transistor:BC846: NPN TRANSISTOR
Q5-Q8 Q14 Q15 = maholli:IRLML2803TRPBF; MANUFACTURER_PART_NUMBER: IRLML2803TRPBF; VENDOR: LITEON
Q9-Q13 Q16 = User-Submitted:MOSFET-PCHANNEL: Generic PMOSFET IRLML2244 - TRANS-11153 (SOT-23 -20V -4.3A) (1.Gate 2.Source 3.Drain) FQP27P06 - COM-10349 <http://www.sparkfun.com/products/10349> (TO-220 -60V -27A) (1.Gate 2.Source 3.Drain); PROD_ID: TRANS-08285
R1 R34 = SparkFun-Resistors:10KOHM-1/10W-1%(0603): RES-00824; PROD_ID: RES-00824
R2 R3 R8-R20 R35 R40-R42 = resistor:R-US_: RESISTOR, American symbol
R4-R6 = SparkFun-Resistors:10KOHM-1/10W-1%(0603): RES-00824; PROD_ID: RES-00824; VALUE: 10K
R7 R21-R32 R36-R39 = SparkFun-Resistors:RESISTOR: Generic Resistor Package
R33 = SparkFun-Resistors:330OHM1/10W1%(0603): RES-00818; PROD_ID: RES-00818
U1 = maholli:MAX708RESA-T; MANUFACTURER_PART_NUMBER: MAX708RESAT; VENDOR: ON Semiconductor
U2 = maholli:FXAS21002
U3 = SparkFun-Sensors:LSM9DS1: LSM9DS1 3D accelerometer, gyroscope & magnetometer The LSM9DS1 is a system-in-package featuring a 3D digital linear acceleration sensor, a 3D digital angular rate sensor, and a 3D digital magnetic sensor. The LSM9DS1 has a linear acceleration full scale of ±2g/±4g/±8/±16 g, a magnetic field full scale of ±4/±8/±12/±16 gauss and an angular rate of ±245/±500/±2000 dps. The LSM9DS1 includes an I2 C serial bus interface supporting standard and fast mode (100 kHz and 400 kHz) and an SPI serial standard interface. Magnetic, accelerometer and gyroscope sensing can be enabled or set in power-down mode separately for smart power management. The LSM9DS1 is available in a plastic land grid array package (LGA) and it is guaranteed to operate over an extended temperature range from -40 °C to +85 °C.; PROD_ID: IC-12536
U4 = samd21-temp:ATSAMD21G: Atmel SAMD21G SMART ARM-Based Microcontroller The Atmel ® | SMART ™ SAM D21 is a series of low-power microcontrollers using the 32-bit ARM ® Cortex ® -M0+ processor, and ranging from 32- to 64-pins with up to 256KB Flash and 32KB of SRAM. The SAM D21 devices operate at a maximum frequency of 48MHz and reach 2.46 CoreMark/MHz. They are designed for simple and intuitive migration with identical peripheral modules, hex compatible code, identical linear address map and pin compatible migration paths between all devices in the product series. All devices include intelligent and flexible peripherals, Atmel Event System for inter-peripheral signaling, and support for capacitive touch button, slider and wheel user interfaces.; PROD_ID: IC-13064
U5 = maholli:MAX4372TEUK+T; MANUFACTURER_PART_NUMBER: MAX4372TEUK+T; VENDOR: Maxim Integrated Products
U6 = BrownSpaceEngineering:LTC4121-4.2
U7 = maholli:TPS54226PWPR; MANUFACTURER_PART_NUMBER: TPS54226PWPR; VENDOR: Texas Instruments
U8 U9 = maholli:PE014005; MANUFACTURER_PART_NUMBER: PE014005; VENDOR: TE Connectivity
U12 = maholli:EP2W+
U13 = RFM23BP:RFM23BP: HopeRF RFM23BP Library by: http://projects.weber-itam.de; SPICEPREFIX: U
U14 = maholli:S1216V8
U15-U18 = maholli:XTB_2018_07_15
U20 = maholli:MR25H40MDF: NVRAM 4Mb 3.3V 512Kx8 SPI Source: Datasheet <https://www.everspin.com/file/217/download>; ARROW_PART_NUMBER: MR25H40MDF; ARROW_PRICE/STOCK: https://www.arrow.com/en/products/mr25h40mdf/everspin-technologies; DESCRIPTION: NVRAM 4Mb 3.3V 512Kx8 SPI; HEIGHT: 0.9mm; MANUFACTURER_NAME: Everspin Technologies; MANUFACTURER_PART_NUMBER: MR25H40MDF
X1-X3 = con-coax:BU-SMA-V: FEMALE SMA CONNECTOR Radiall distributor RS 112-3794; OC_FARNELL: unknown; OC_NEWARK: unknown
Y1 = samd21-temp:CRYSTAL: Various standard crystals. Proven footprints.; PROD_ID: XTAL-13062

## Net classes
0 default: width 0.272 mm, drill 0.381 mm, clearance 0.127 mm